# EasyEDA Pro project 主控板.epro

# Schematic Schematic2
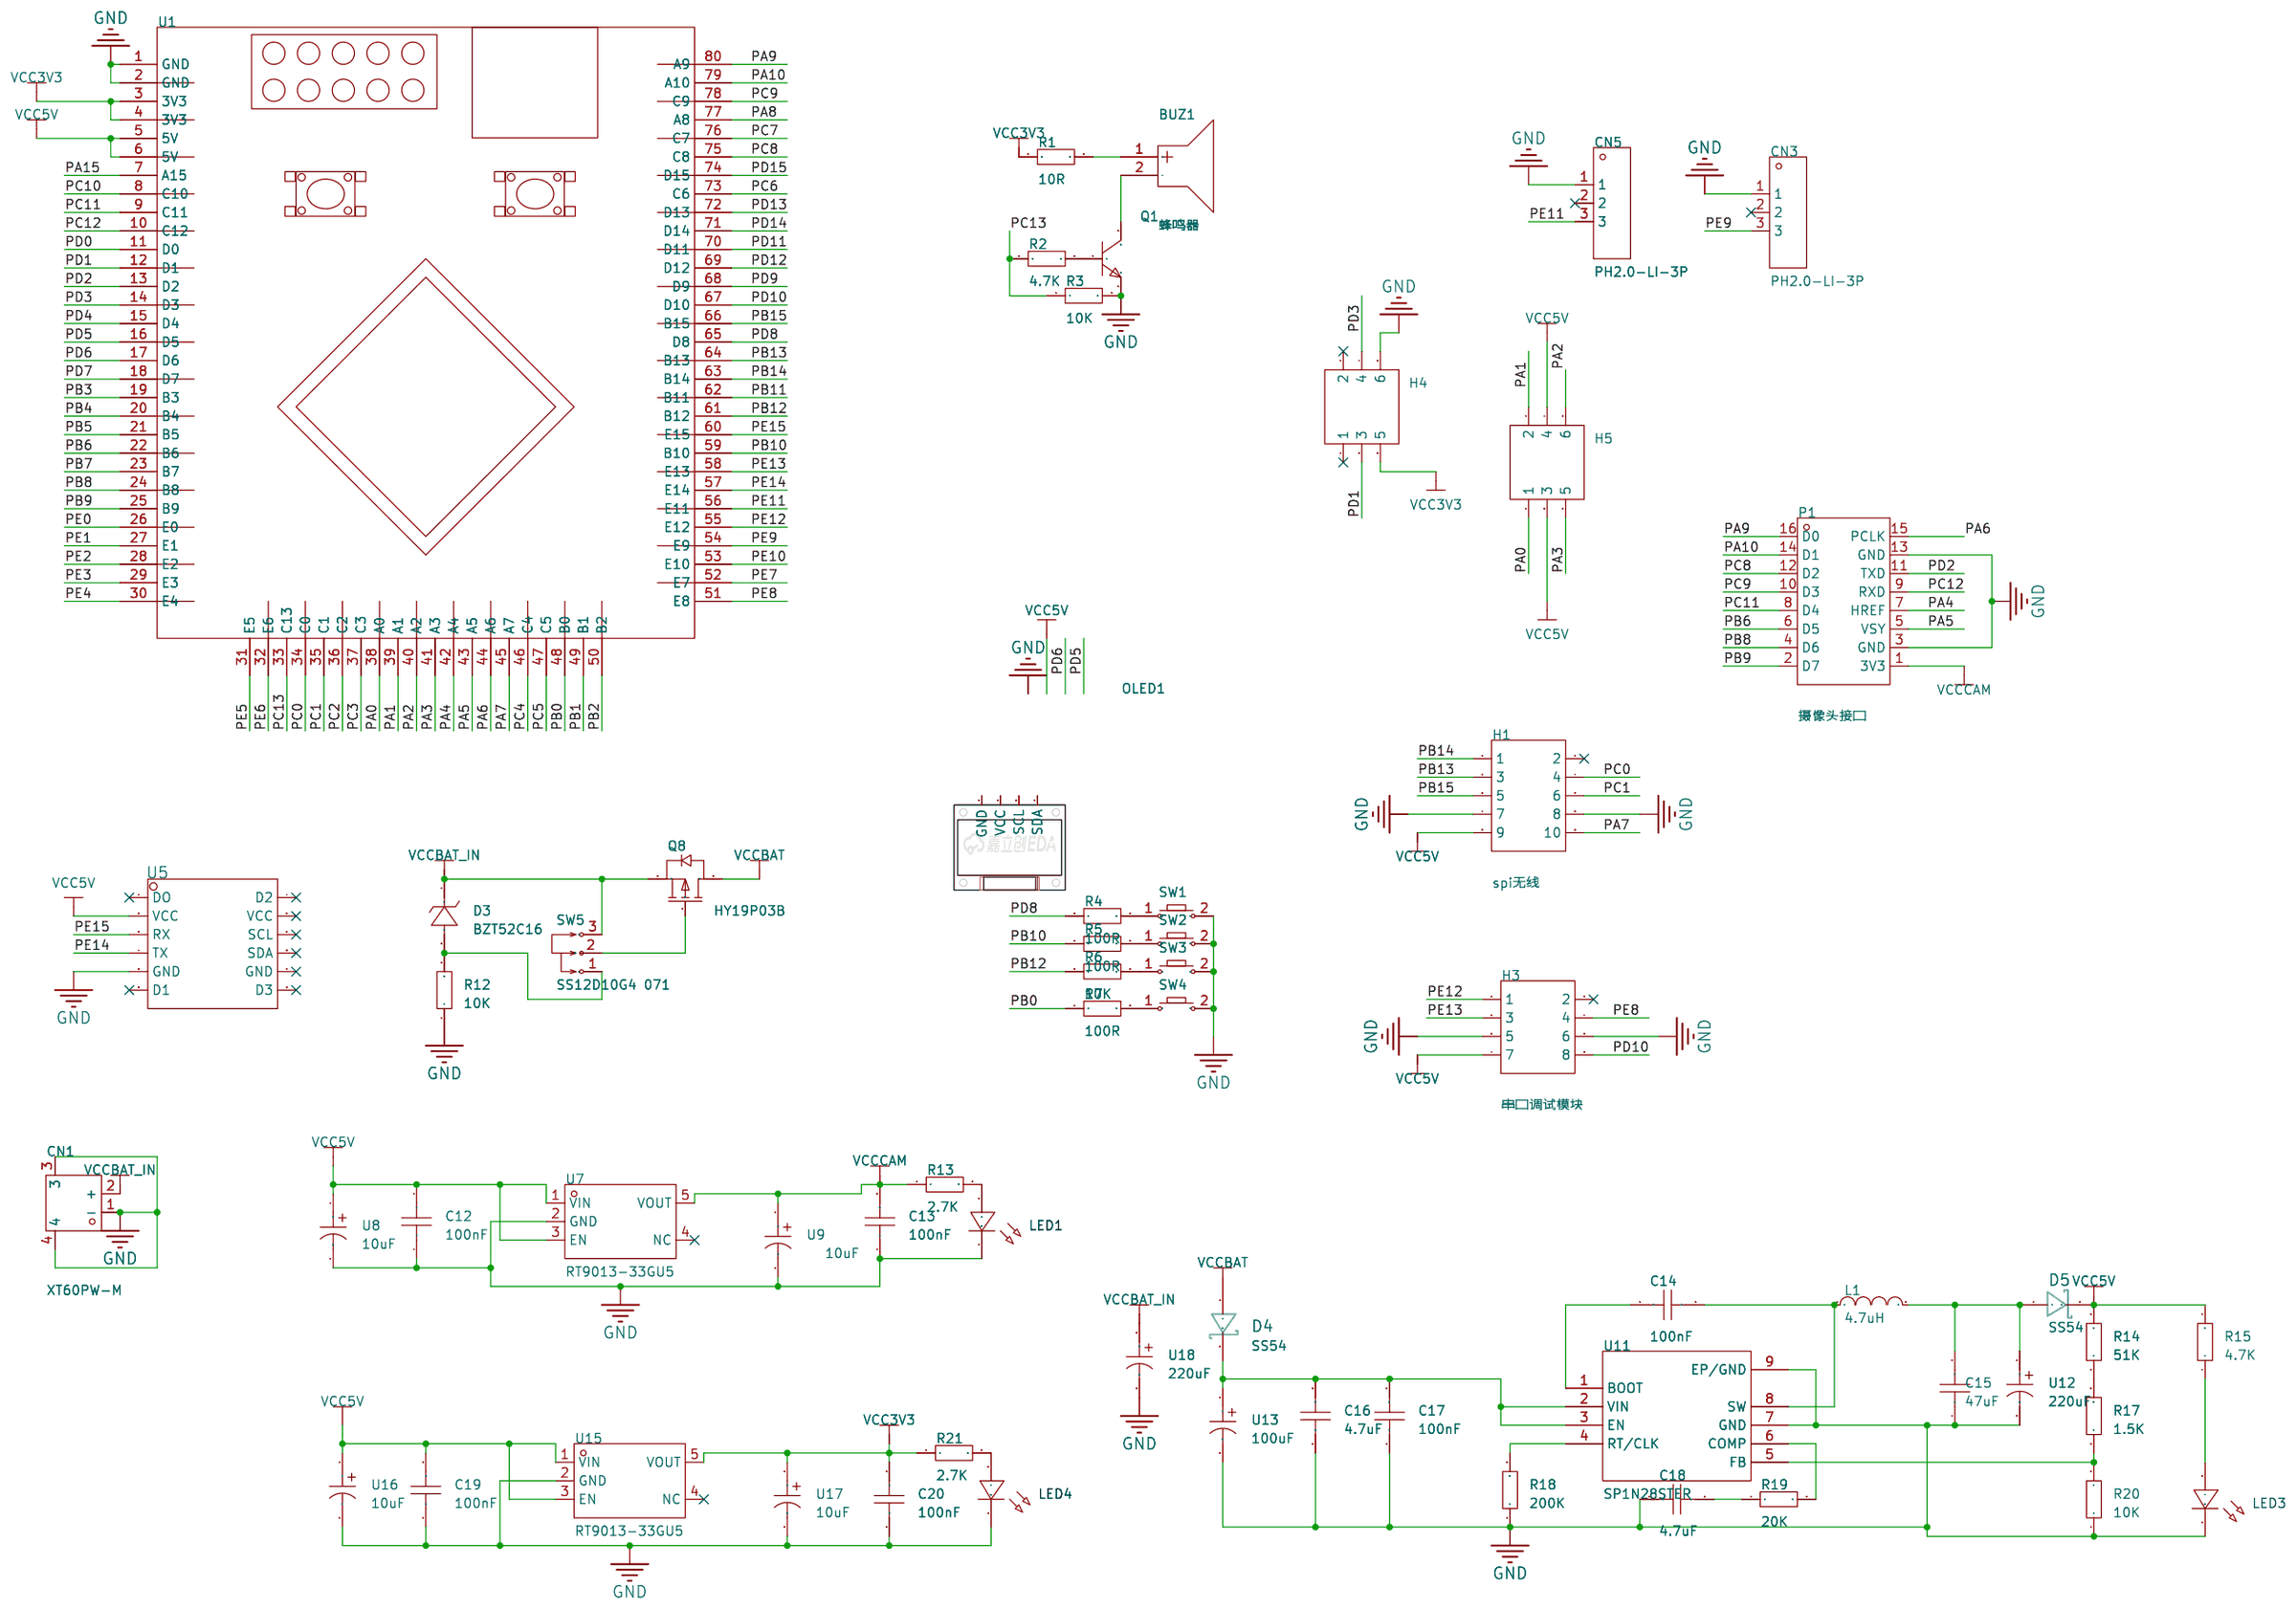
[diagram p0: schematic sheet]

## Parts
BUZ1  蜂鸣器  [BUZ-TH_BD9.0-P5.00-D0.6-FD]
C12  100nF  [C0603]
C13  100nF  [C0603]
C14  100nF  [C0603]
C15  47uF  [c1206]
C16  4.7uF  [C0603]
C17  100nF  [C0603]
C18  4.7uF  [C0603]
C19  100nF  [C0603]
C20  100nF  [C0603]
CN1  XT60PW-M  [CONN-TH_XT60PW-M]
CN3  PH2.0-LI-3P  [CONN-TH_3P-P2.00_HX20007-3A]
CN5  PH2.0-LI-3P  [CONN-TH_3P-P2.00_HX20007-3A]
D3  BZT52C16  [SOD-123_L2.7-W1.6-LS3.7-RD]
D4  SS54  [do-214ac_l4.7-w2.6-ls5.3-rd]
D5  SS54  [do-214ac_l4.7-w2.6-ls5.3-rd]
H1  spi无线  [HDR-TH_10P-P2.54-V-F-R2-C5-S2.54]
H3  串口调试模块  [HDR-TH_8P-P2.54-V-F-R2-C4-S2.54-1]
H4  -  [HDR-TH_6P-P2.54-V-F-R2-C3-S2.54]
H5  -  [HDR-TH_6P-P2.54-V-F-R2-C3-S2.54]
L1  4.7uH  [ind-smd_l4.2-w4.2_mcw-0420]
LED1  -  [LED_0603]
LED3  -  [LED_0603]
LED4  -  [LED_0603]
OLED1  -  [0.96OLED_4P]
P1  摄像头接口  [总钻风摄像头接口]
Q1  -  [S8050_SOT-23]
Q8  HY19P03B  [to-252-2_l6.5-w6.2-p4.57-ls10.0-br-cw]
R1  10R  [R0603]
R2  4.7K  [R0603]
R3  10K  [R0603]
R4  10K  [R0603]
R5  10K  [R0603]
R6  10K  [R0603]
R7  10K  [R0603]
R12  10K  [R0603]
R13  2.7K  [R0603]
R14  51K  [R0603]
R15  4.7K  [R0603]
R17  1.5K  [R0603]
R18  200K  [R0603]
R19  20K  [R0603]
R20  10K  [R0603]
R21  2.7K  [R0603]
SW1  -  [Key_SMD_3x4x2]
SW2  -  [Key_SMD_3x4x2]
SW3  -  [Key_SMD_3x4x2]
SW4  -  [Key_SMD_3x4x2]
SW5  SS12D10G4 071  [SW-TH_SHOU-HAN_SS12D10G4]
U1  -  [CH32V307VCT6核心板]
U5  -  [维特智能JY901S]
U7  RT9013-33GU5  [sot-23-5_l2.9-w1.7-p0.95-ls2.8-bl]
U8  10uF  [case-a_3216]
U9  10uF  [case-a_3216]
U11  SP1N28STER  [ESOP-8_L4.9-W3.9-P1.27-LS6.0-TL-EP]
U12  220uF  [CAP-SMD_L7.3-W4.3-FD]
U13  100uF  [case-c_6032]
U15  RT9013-33GU5  [sot-23-5_l2.9-w1.7-p0.95-ls2.8-bl]
U16  10uF  [case-a_3216]
U17  10uF  [case-a_3216]
U18  220uF  [CAP-SMD_L7.3-W4.3-FD]

## Library data of the parts
BUZ1 = 蜂鸣器: Supplier Part: C9900020875; Supplier Footprint: 插件; JLCPCB Part Class: 扩展库; Supplier: LCSC
C12-C20 = CAP_0603: Supplier Footprint: 0603
CN1 = XT60PW-M: 类别:-;类型1:-;; LCSC Part Name: AMASS(艾迈斯)航模插头xt60连接器150公母对接pw锂电池公头 板插卧式XT60PW-M; Supplier Part: C98732; Manufacturer: AMASS(艾迈斯); JLCPCB Part Class: 扩展库; Datasheet: https://atta.szlcsc.com/upload/public/pdf/source/20190916/C428722_DFF78979486FCB0B58C1FC563067EC88.pdf; Supplier: LCSC; Brand: 艾迈斯; Type: 卧式插头; Colour: 黄色; InterfaceType: 公头
CN3 CN5 = PH2.0-LI-3P: Supplier Part: C9900014054; JLCPCB Part Class: 扩展库; Supplier: LCSC
D3 = BZT52C16: 稳压值(标称值):-;功率:500mW;精度:-;; Supplier Part: C707145; Manufacturer: Slkor(萨科微); Supplier Footprint: SOD-123; JLCPCB Part Class: 扩展库; Datasheet: https://atta.szlcsc.com/upload/public/pdf/source/20200721/C707125_BAEA70ACC1B0F60BBAC1FD71D8806D24.pdf; Supplier: LCSC; Reverse Leakage Current (Ir): 100nA@11.2V; Power Dissipation: 500mW
D4 D5 = SS54: Supplier: LCSC; Manufacturer: MDD; Supplier Part: C22452; JLCPCB Part Class: 基础库
H1 = HDR-F_2.54_2x5: Supplier Part: C92270; Supplier Footprint: 插件
H3 = HDR-F_2.54_2x4: Supplier Part: C92271; Supplier Footprint: 插件
H4 H5 = HDR-F_2.54_2x3: Supplier Part: C92272; Supplier Footprint: 插件
L1 = L_0603: Supplier Footprint: L0603
LED1 LED3 LED4 = LED_0603-G: Supplier Footprint: 0603
OLED1 = 0.96OLED模块_4P: Supplier Footprint: 插件
P1 = 总钻风
Q1 = S8050_SOT_NPN: Supplier Footprint: SOT-23
Q8 = HY19P03B: 类型:P沟道;漏源电压(Vdss):30V;连续漏极电流(Id):90A;功率(Pd):96W;导通电阻(RDS(on)@Vgs,Id):6mΩ@10V,45A;阈值电压(Vgs(th)@Id):3V@250uA;; LCSC Part Name: P沟道 耐压:30V 电流:90A; Supplier Part: C410273; Manufacturer: HUAYI(华羿微); Supplier Footprint: TO-263-2; JLCPCB Part Class: 扩展库; Datasheet: https://atta.szlcsc.com/upload/public/pdf/source/20190807/C410273_E48EFC57468E7FED7A0093963248504B.pdf; Supplier: LCSC; Type: P沟道; Drain Source Voltage (Vdss): 30V; Continuous Drain Current (Id): 90A; Power Dissipation (Pd): 96W; Drain Source On Resistance (RDS(on)@Vgs,Id): 6mΩ@10V,45A; Gate Threshold Voltage (Vgs(th)@Id): 3V@250uA
R1-R7 R12-R15 R17-R21 = Res_0603: Supplier Footprint: 0603
SW1-SW4 = Key_SMD_3x4x2: Supplier Footprint: SMD
SW5 = SS12D10G4 071: 电路结构:单刀双掷;安装方式:直插;开关颜色:-;额定电流(DC):2A;额定电压(DC):125V;额定电流(AC):-;额定电压(AC):-;机械寿命:3千次;; Supplier Part: C2887259; Manufacturer: SHOU HAN(首韩); Supplier Footprint: 插件; JLCPCB Part Class: 扩展库; Datasheet: https://atta.szlcsc.com/upload/public/pdf/source/20210820/80D1704BBF3FCEE0435FCAA54C61E0A3.pdf; Supplier: LCSC; Circuit: 单刀双掷; Pin Style: PC引脚; Switch Length: 12.7mm; Switch Width: 6.7mm; Switch Height: 6.4mm; Mounting Style: 直插; Current Rating (DC): 2A; Voltage Rating (DC): 125V; Mechanical Life: 3千次; Operating Temperature: -16℃~+60℃
U1 = CH32V307VCT6
U5 = JY901S: 9轴姿态角度传感器
U7 U15 = RT9013-33GU5: 输出类型:固定;最大输入电压:5.5V;输出电压:3.3V;最大输出电流:500mA;电源纹波抑制比(PSRR):50dB@(10kHz);输出极性:正极;; Supplier Part: C3034127; Manufacturer: RICHTEK(立锜); Supplier Footprint: SC-70-5; JLCPCB Part Class: 扩展库; Datasheet: https://atta.szlcsc.com/upload/public/pdf/source/20220613/DD4CF7EAF1F9097C51D5D7DB1A8622BA.pdf; Supplier: LCSC; Output Type: 固定; Maximum Input Voltage: 5.5V; Output Voltage: 3.3V; MAX Output Current: 500mA; Power Supply Rejection Ratio (PSRR): 50dB@(10kHz); Dropout Voltage: 400mV@(500mA); standby current: 50uA; Operating Temperature: -40℃~+85℃; Output Polarity: 正极; Number of Outputs: 1
U8 U9 U12 U13 U16-U18 = TPSE477M010R0050: 容值:470uF;精度:±20%;额定电压:10V;等效串联电阻:50mΩ@100kHZ;; LCSC Part Name: 470uF ±20% 10V; Supplier Part: C1954116; Manufacturer: Kyocera AVX; Supplier Footprint: CASE-E-7343; JLCPCB Part Class: 扩展库; Datasheet: https://atta.szlcsc.com/upload/public/pdf/source/20210915/CADAB6E31BEA793A8D1CD3C13B75E922.pdf; Supplier: LCSC; Tolerance: ±20%; Rated Voltage: 10V; Equivalent Series Resistance(ESR): 50mΩ@100kHZ; Operating Temperature: -55℃~+125℃
U11 = SP1N28STER: Supplier: LCSC; Manufacturer: TI(德州仪器); Manufacturer Part: TPS5430DDAR; Supplier Part: C9864; JLCPCB Part Class: 基础库; LCSC Part Name: TPS5430DDAR; Supplier Footprint: SOP-8-EP; Datasheet: https://www.ti.com/cn/lit/gpn/tps5430; Function: 降压型; Synchronous Rectification: 否; Output Type: 可调; Number of Outputs: 1; Topology: 降压式; Input Voltage: 5.5V~36V; Output Voltage: 1.221V~32.04V; Output Current (Max): 3A; Switching Frequency: 500kHz; Operating Temperature: -40℃~+125℃@(TJ)

## Nets
GND: C12.1 C13.1 C15.1 C16.1 C17.1 C18.1 C19.1 C20.1 CN1.1(-) CN1.3 CN1.4 CN3.1 CN5.1 H1.7 H1.8 H3.5 H3.6 H4.6 LED1.1(C) LED3.1(C) LED4.1(C) P1.3(GND) P1.13(GND) Q1.2 R3.2 R12.1 R18.1 R20.1 SW1.2 SW2.2 SW3.2 SW4.2 U1.1(GND) U1.2(GND) U5.5(GND) U7.2(GND) U8.2 U9.2 U11.7(GND) U11.9(EP/GND) U12.2 U13.2 U15.2(GND) U16.2 U17.2 U18.2
VCC3V3: C20.2 H4.5 R1.1 R21.1 U1.3(3V3) U1.4(3V3) U15.5(VOUT) U17.1
VCC5V: C12.2 C19.2 D5.2(K) H1.9 H3.7 H5.3 H5.4 R14.2 R15.2 U1.5(5V) U1.6(5V) U5.2(VCC) U7.1(VIN) U7.3(EN) U8.1 U15.1(VIN) U15.3(EN) U16.1
VCCBAT: D4.1(A) Q8.2(D)
VCCBAT_IN: CN1.2(+) D3.1(K) Q8.3(S) SW5.3 U18.1
VCCCAM: C13.2 P1.1(3V3) R13.1 U7.5(VOUT) U9.1
PA0: H5.1 U1.38(A0)
PA1: H5.2 U1.39(A1)
PA2: H5.6 U1.40(A2)
PA3: H5.5 U1.41(A3)
PA4: P1.7(HREF) U1.42(A4)
PA5: P1.5(VSY) U1.43(A5)
PA6: P1.15(PCLK) U1.44(A6)
PA7: H1.10 U1.45(A7)
PA8: U1.77(A8)
PA9: P1.16(D0) U1.80(A9)
PA10: P1.14(D1) U1.79(A10)
PA15: U1.7(A15)
PB0: R7.1 U1.48(B0)
PB1: U1.49(B1)
PB2: U1.50(B2)
PB3: U1.19(B3)
PB4: U1.20(B4)
PB5: U1.21(B5)
PB6: P1.6(D5) U1.22(B6)
PB7: U1.23(B7)
PB8: P1.4(D6) U1.24(B8)
PB9: P1.2(D7) U1.25(B9)
PB10: R5.1 U1.59(B10)
PB11: U1.62(B11)
PB12: R6.1 U1.61(B12)
PB13: H1.3 U1.64(B13)
PB14: H1.1 U1.63(B14)
PB15: H1.5 U1.66(B15)
PC0: H1.4 U1.34(C0)
PC1: H1.6 U1.35(C1)
PC2: U1.36(C2)
PC3: U1.37(C3)
PC4: U1.46(C4)
PC5: U1.47(C5)
PC6: U1.73(C6)
PC7: U1.76(C7)
PC8: P1.12(D2) U1.75(C8)
PC9: P1.10(D3) U1.78(C9)
PC10: U1.8(C10)
PC11: P1.8(D4) U1.9(C11)
PC12: P1.9(RXD) U1.10(C12)
PC13: R2.1 R3.1 U1.33(C13)
PD0: U1.11(D0)
PD1: H4.3 U1.12(D1)
PD2: P1.11(TXD) U1.13(D2)
PD3: H4.4 U1.14(D3)
PD4: U1.15(D4)
PD5: U1.16(D5)
PD6: U1.17(D6)
PD7: U1.18(D7)
PD8: R4.1 U1.65(D8)
PD9: U1.68(D9)
PD10: H3.8 U1.67(D10)
PD11: U1.70(D11)
PD12: U1.69(D12)
PD13: U1.72(D13)
PD14: U1.71(D14)
PD15: U1.74(D15)
PE0: U1.26(E0)
PE1: U1.27(E1)
PE2: U1.28(E2)
PE3: U1.29(E3)
PE4: U1.30(E4)
PE5: U1.31(E5)
PE6: U1.32(E6)
PE7: U1.52(E7)
PE8: H3.4 U1.51(E8)
PE9: CN3.3 U1.54(E9)
PE10: U1.53(E10)
PE11: CN5.3 U1.56(E11)
PE12: H3.1 U1.55(E12)
PE13: H3.3 U1.58(E13)
PE14: U1.57(E14) U5.4(TX)
PE15: U1.60(E15) U5.3(RX)
$1N2384: Q8.1(G) SW5.2
$1N2385: D3.2(A) R12.2 SW5.1
$1N2976: LED1.2(A) R13.2
$1N2980: LED4.2(A) R21.2
$1N3513: C16.2 C17.2 D4.2(K) U11.2(VIN) U11.3(EN) U13.1
$1N3514: R18.2 U11.4(RT/CLK)
$1N3515: C14.1 U11.1(BOOT)
$1N3516: C14.2 L1.1 U11.8(SW)
$1N3518: C15.2 D5.1(A) L1.2 U12.1
$1N3520: R14.1 R17.2
$1N3521: R17.1 R20.2 U11.5(FB)
$1N3522: C18.2 R19.1
$1N3523: R19.2 U11.6(COMP)
$1N3524: LED3.2(A) R15.1
$1N3913: R4.2 SW1.1
$1N3914: R5.2 SW2.1
$1N3915: R6.2 SW3.1
$1N3916: R7.2 SW4.1
$1N4132: Q1.1 R2.2
$1N4134: BUZ1.1(+) R1.2
$1N4135: BUZ1.2(-) Q1.3

Not connected (* = marked no-connect by the designer): CN3 2*; CN5 2*; H1 2*; H3 2*; H4 1* 2*; OLED1 1(GND) 2(VCC) 3(SCL) 4(SDA); U5 1(DO)* 6(D1)* 7(D2)* 8(VCC)* 9(SCL)* 10(SDA)* 11(GND)* 12(D3)*; U7 4(NC)*; U15 4(NC)*

# Board PCB2
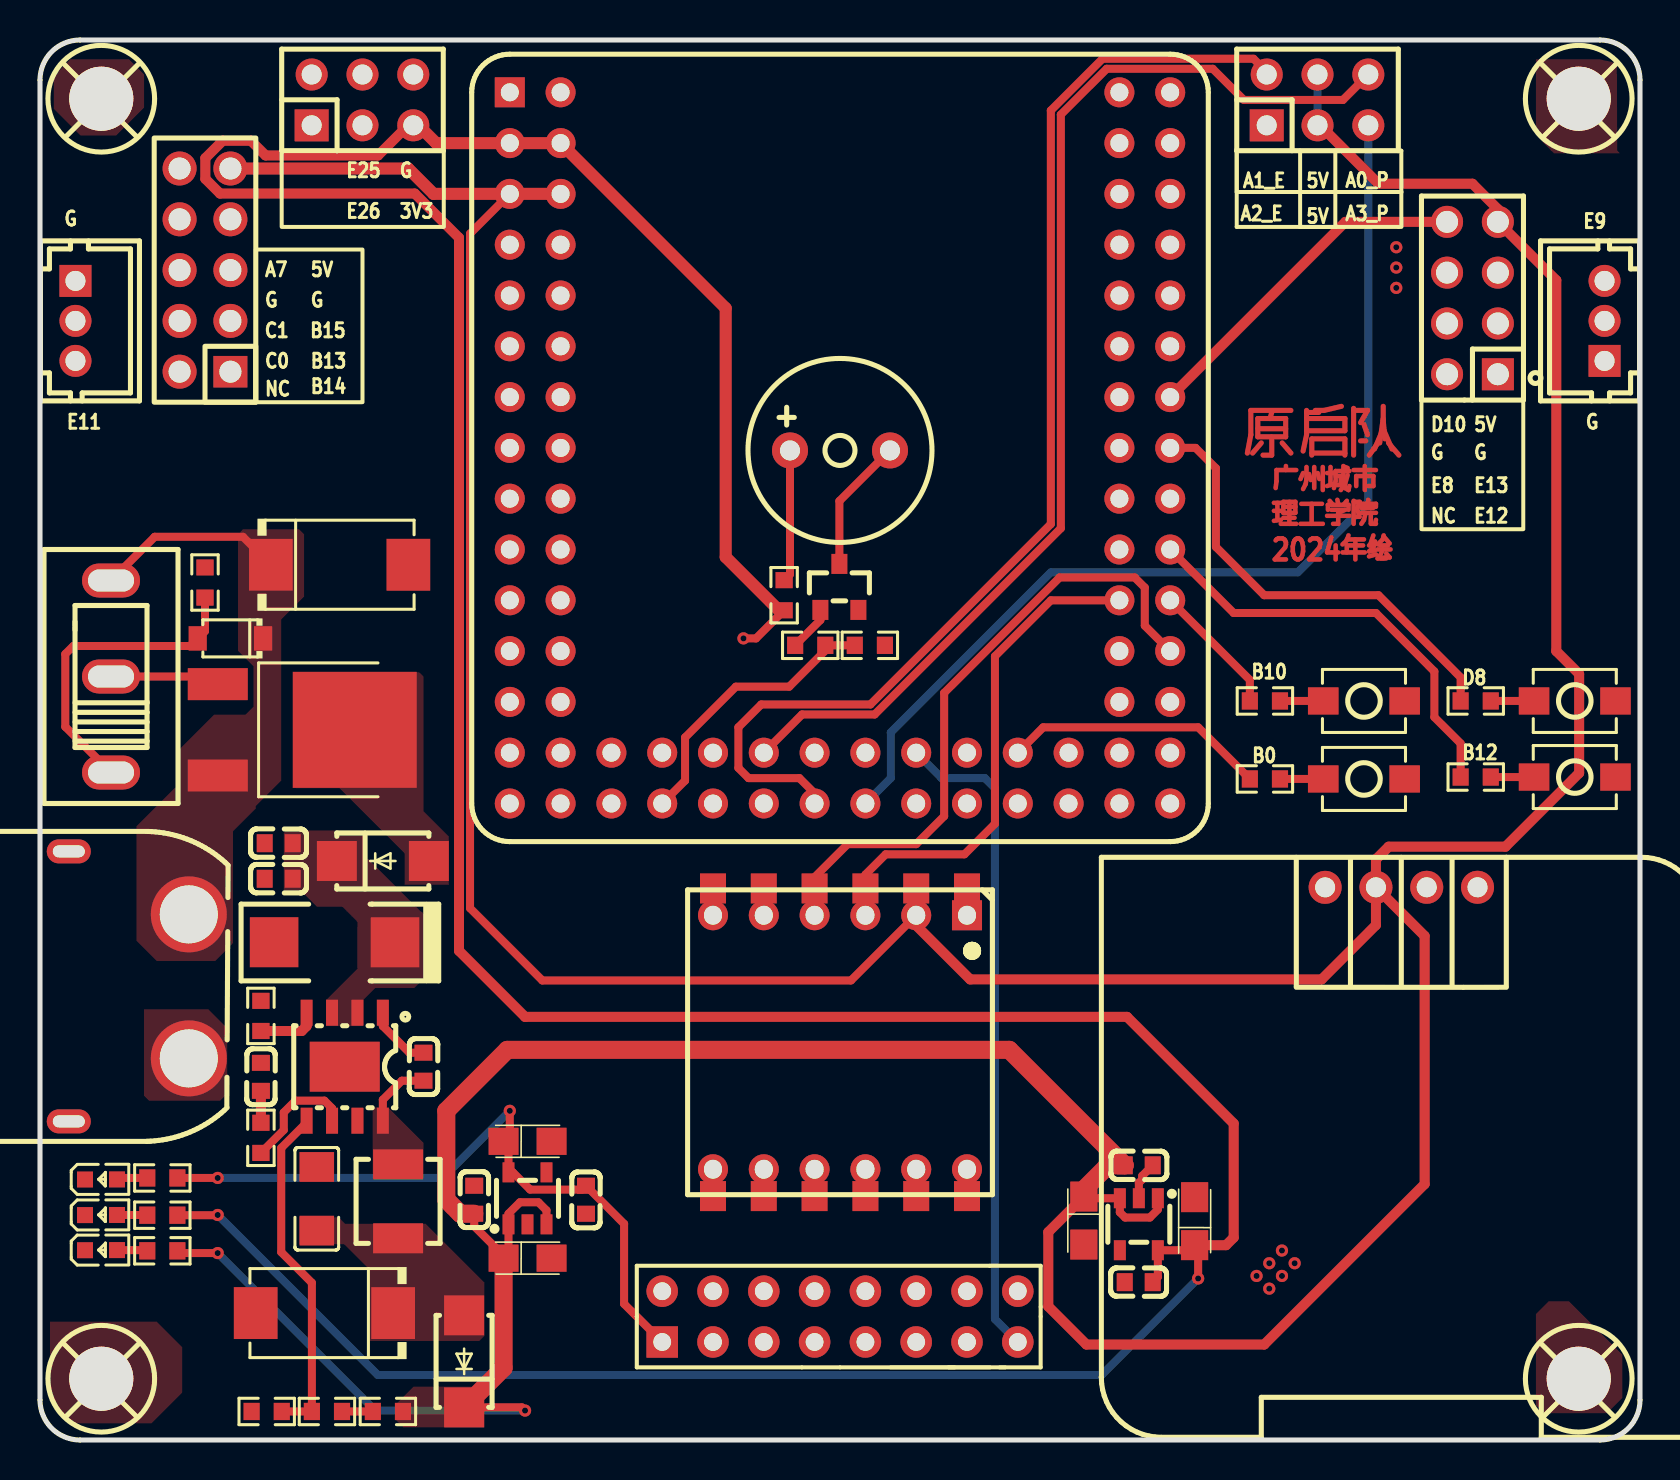
[diagram p1: board, top side]
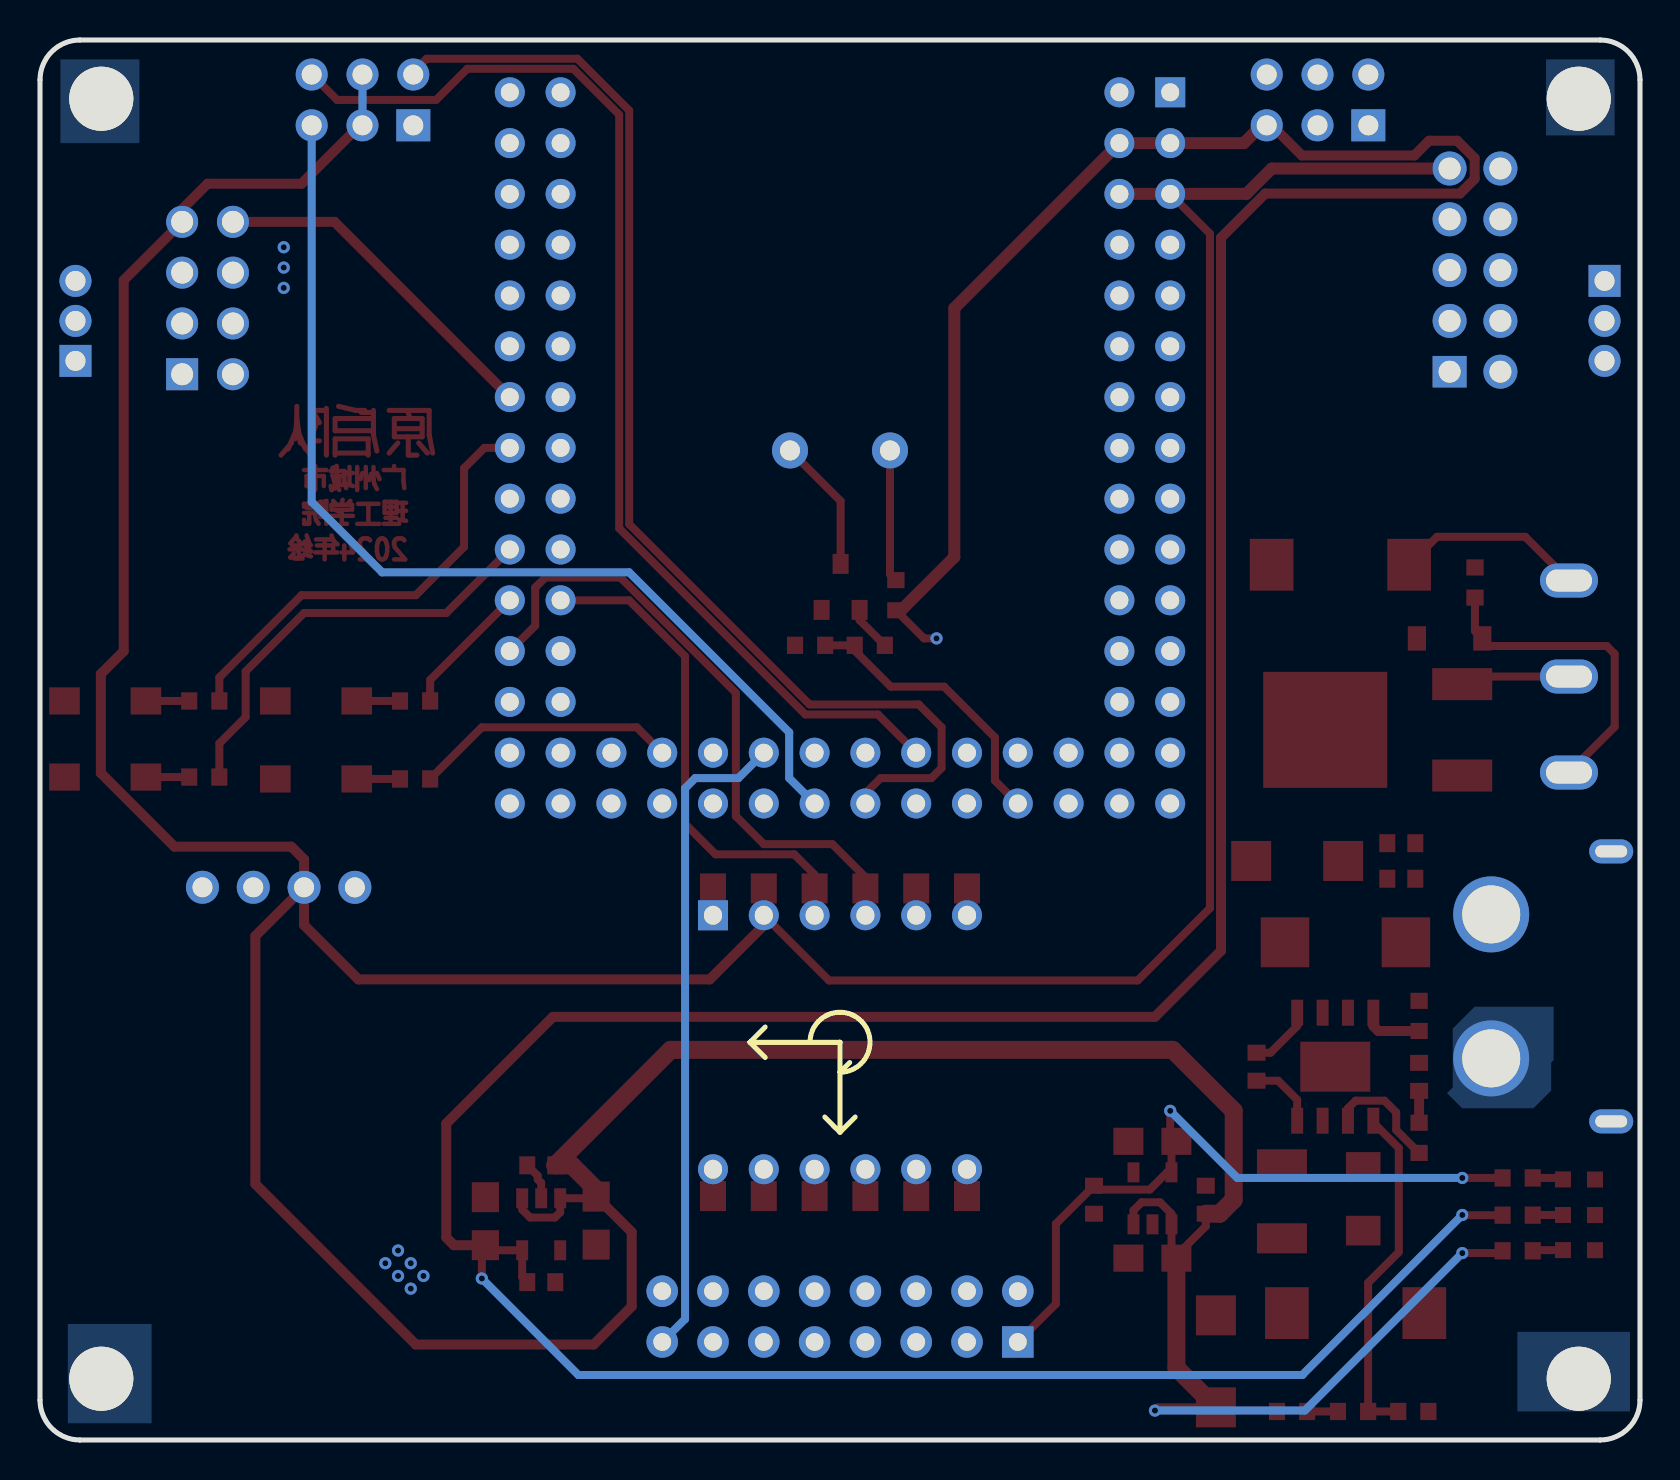
[diagram p2: board, bottom side, seen from below]

Outline 80 x 70 mm; copper layers: Top Layer, Inner1, Inner2, Bottom Layer. Coordinates in mm from the lower left corner of the outline.
Outline path: 0,68 0,2 arc(0.59,0.59) 2,0 78,0 arc(79.41,0.59) 80,2 80,68 arc(79.41,69.41) 78,70 2,70 arc(0.59,69.41) 0,68
Stack: Top Layer 0.035mm 外层铜厚1oz / Dielectric1 0.2104mm 7628 RC49% 8.6mil / Inner1 0.0152mm 内层铜厚 / Dielectric2 1.065mm 1.1mm H/HOZ 含铜 / Inner2 0.0152mm 内层铜厚 / Dielectric3 0.2104mm 7628 RC49% 8.6mil / Bottom Layer 0.035mm 外层铜厚1oz

## Design rules (mm)
template: JLCPCB Capability(Two Layers Board)
spacing copperThickness1oz (default): track to track 0.102, other pairs 0.152 to 0.3
spacing copperThickness2oz: track to track 0.203, other pairs 0.152 to 0.3
track width copperThickness1oz (default): min 0.127, default 0.254, max 2.54
track width copperThickness2oz: min 0.203, default 0.254, max 2.54
differential pair differentialPair (default): width min 0.127, default 0.254, max 2.54; gap min 0.152, default 0.152
via viaSize (default): diameter min 0.5, default 0.61, max 10; hole min 0.3, default 0.305, max 6.3

## Placement (name value [footprint] x y rotation side)
BUZ1  蜂鸣器  [BUZ-TH_BD9.0-P5.00-D0.6-FD]  40 49.48 0 top
C12  100nF  [C0603]  21.71 12.01 270 top
C13  100nF  [C0603]  27.3 12.01 90 top
C14  100nF  [C0603]  19.17 18.66 270 top
C15  47uF  [c1206]  13.84 12.06 270 top
C16  4.7uF  [C0603]  11.93 29.84 0 top
C17  100nF  [C0603]  11.93 28.06 0 top
C18  4.7uF  [C0603]  11.05 18.16 270 top
C19  100nF  [C0603]  54.94 13.74 180 top
C20  100nF  [C0603]  54.94 7.89 0 top
CN1  XT60PW-M  [CONN-TH_XT60PW-M]  4.44 22.68 0 top
CN3  PH2.0-LI-3P  [CONN-TH_3P-P2.00_HX20007-3A]  78.23 55.95 270 top
CN5  PH2.0-LI-3P  [CONN-TH_3P-P2.00_HX20007-3A]  1.77 55.95 90 top
D3  BZT52C16  [SOD-123_L2.7-W1.6-LS3.7-RD]  9.52 40.08 180 top
D4  SS54  [do-214ac_l4.7-w2.6-ls5.3-rd]  17.14 28.95 0 top
D5  SS54  [do-214ac_l4.7-w2.6-ls5.3-rd]  21.21 3.93 90 top
H1  spi无线  [HDR-TH_10P-P2.54-V-F-R2-C5-S2.54]  8.25 58.5 90 top
H3  串口调试模块  [HDR-TH_8P-P2.54-V-F-R2-C4-S2.54-1]  71.62 57.1 90 top
H4  -  [HDR-TH_6P-P2.54-V-F-R2-C3-S2.54]  16.12 67 0 top
H5  -  [HDR-TH_6P-P2.54-V-F-R2-C3-S2.54]  63.88 67 0 top
L1  4.7uH  [ind-smd_l4.2-w4.2_mcw-0420]  17.9 11.93 270 top
LED1  -  [LED_0603]  3.1 13.03 0 top
LED3  -  [LED_0603]  3.1 9.5 0 top
LED4  -  [LED_0603]  3.1 11.26 0 top
OLED1  -  [0.96OLED_4P]  68.07 27.63 0 top
P1  摄像头接口  [总钻风摄像头接口]  38.73 6.17 90 top
Q1  -  [S8050_SOT-23]  39.84 42.66 270 top
Q8  HY19P03B  [to-252-2_l6.5-w6.2-p4.57-ls10.0-br-cw]  12.31 35.51 180 top
R1  10R  [R0603]  37.21 42.24 90 top
R2  4.7K  [R0603]  38.51 39.73 180 top
R3  10K  [R0603]  41.49 39.73 0 top
R4  10K  [R0603]  71.79 36.95 0 top
R5  10K  [R0603]  61.25 36.95 0 top
R6  10K  [R0603]  71.79 33.15 0 top
R7  10K  [R0603]  61.25 33.05 0 top
R12  10K  [R0603]  8.25 42.87 270 top
R13  2.7K  [R0603]  6.12 13.1 180 top
R14  51K  [R0603]  17.4 1.43 0 top
R15  4.7K  [R0603]  6.12 9.46 0 top
R17  1.5K  [R0603]  14.35 1.43 0 top
R18  200K  [R0603]  11.05 21.2 270 top
R19  20K  [R0603]  11.05 15.11 270 top
R20  10K  [R0603]  11.33 1.43 0 top
R21  2.7K  [R0603]  6.12 11.24 180 top
SCREW1  -  [M3螺丝]  3.13 67 0 top
SCREW2  -  [M3螺丝]  77 67 0 top
SCREW3  -  [M3螺丝]  77 3 0 top
SCREW4  -  [M3螺丝]  3.13 3 0 top
SW1  -  [Key_SMD_3x4x2]  76.74 36.95 0 top
SW2  -  [Key_SMD_3x4x2]  66.2 36.95 0 top
SW3  -  [Key_SMD_3x4x2]  76.74 33.15 0 top
SW4  -  [Key_SMD_3x4x2]  66.2 33.05 0 top
SW5  SS12D10G4 071  [SW-TH_SHOU-HAN_SS12D10G4]  3.55 38.17 90 top
U1  -  [CH32V307VCT6核心板]  53.59 54.94 0 top
U5  -  [维特智能JY901S]  40 19.89 270 top
U7  RT9013-33GU5  [sot-23-5_l2.9-w1.7-p0.95-ls2.8-bl]  24.38 12.08 0 top
U8  10uF  [case-a_3216]  24.38 9.09 0 top
U9  10uF  [case-a_3216]  24.38 14.93 0 top
U11  SP1N28STER  [ESOP-8_L4.9-W3.9-P1.27-LS6.0-TL-EP]  15.24 18.66 270 top
U12  220uF  [CAP-SMD_L7.3-W4.3-FD]  14.22 6.35 180 top
U13  100uF  [case-c_6032]  14.73 24.89 0 top
U15  RT9013-33GU5  [sot-23-5_l2.9-w1.7-p0.95-ls2.8-bl]  54.94 10.79 180 top
U16  10uF  [case-a_3216]  52.19 10.97 270 top
U17  10uF  [case-a_3216]  57.73 10.94 90 top
U18  220uF  [CAP-SMD_L7.3-W4.3-FD]  14.98 43.76 0 top

## Footprints (pads in the part's own frame, mm; a bottom-side part is the same pattern mirrored in y, then rotated)
0.96OLED_4P
  round 1.65 hole 1: 1(-3.81,-0.002) 2(-1.27,0.002) 3(1.27,0.002) 4(3.81,0.002)
BUZ-TH_BD9.0-P5.00-D0.6-FD
  round 1.8 hole 1: 1(-2.5,0) 2(2.5,0)
C0603
  rect 0.8x0.9 smd: 1(-0.7,0) 2(0.7,0)
c1206
  rect 1.485x1.728 smd: 1(-1.593,0) 2(1.593,0)
CAP-SMD_L7.3-W4.3-FD
  rect 2.185x2.592 smd: 1(-3.437,0) 2(3.437,0)
case-a_3216
  rect 1.5x1.359 smd: 1(-1.2,0) 2(1.2,0)
case-c_6032
  rect 2.425x2.5 smd: 1(3.022,0) 2(-3.022,0)
CH32V307VCT6核心板
  rect 1.5x1.5 hole 0.9: 1(-30.099,12.446)
  round 1.5 hole 0.9: 2(-27.559,12.446) 3(-30.099,9.906) 4(-27.559,9.906) 5(-30.099,7.366) 6(-27.559,7.366) 7(-30.099,4.826) 8(-27.559,4.826) 9(-30.099,2.286) 10(-27.559,2.286) 11(-30.099,-0.254) 12(-27.559,-0.254) 13(-30.099,-2.794) 14(-27.559,-2.794) 15(-30.099,-5.334) 16(-27.559,-5.334) 17(-30.099,-7.874) 18(-27.559,-7.874) 19(-30.099,-10.414) 20(-27.559,-10.414) 21(-30.099,-12.954) 22(-27.559,-12.954) 23(-30.099,-15.494) 24(-27.559,-15.494) 25(-30.099,-18.034) 26(-27.559,-18.034) 27(-30.099,-20.574) 28(-27.559,-20.574) 29(-30.099,-23.114) 30(-27.559,-23.114) 31(-25.019,-23.114) 32(-25.019,-20.574) 33(-22.479,-23.114) 34(-22.479,-20.574) 35(-19.939,-23.114) 36(-19.939,-20.574) 37(-17.399,-23.114) 38(-17.399,-20.574) 39(-14.859,-23.114) 40(-14.859,-20.574) 41(-12.319,-23.114) 42(-12.319,-20.574) 43(-9.779,-23.114) 44(-9.779,-20.574) 45(-7.239,-23.114) 46(-7.239,-20.574) 47(-4.699,-23.114) 48(-4.699,-20.574) 49(-2.159,-23.114) 50(-2.159,-20.574) 51(2.921,-23.114) 52(0.381,-23.114) 53(2.921,-20.574) 54(0.381,-20.574) 55(2.921,-18.034) 56(0.381,-18.034) 57(2.921,-15.494) 58(0.381,-15.494) 59(2.921,-12.954) 60(0.381,-12.954) 61(2.921,-10.414) 62(0.381,-10.414) 63(2.921,-7.874) 64(0.381,-7.874) 65(2.921,-5.334) 66(0.381,-5.334) 67(2.921,-2.794) 68(0.381,-2.794) 69(2.921,-0.254) 70(0.381,-0.254) 71(2.921,2.286) 72(0.381,2.286) 73(2.921,4.826) 74(0.381,4.826) 75(2.921,7.366) 76(0.381,7.366) 77(2.921,9.906) 78(0.381,9.906) 79(2.921,12.446) 80(0.381,12.446)
CONN-TH_3P-P2.00_HX20007-3A
  rect 1.6x1.6 hole 1: 1(2,0)
  round 1.6 hole 1: 2(0,0) 3(-2,0)
CONN-TH_XT60PW-M
  round 3.8 hole 2.9: 1(3,-3.6) 2(3,3.6)
  oval 2.2x1.2 hole 1.6x0.6: 3(-3,6.75) 4(-3,-6.75)
do-214ac_l4.7-w2.6-ls5.3-rd
  rect 2x2 smd: 1(2.3,0) 2(-2.3,0)
ESOP-8_L4.9-W3.9-P1.27-LS6.0-TL-EP
  rect 1.3x0.6 smd: 1(-2.7,1.905) 2(-2.7,0.635) 3(-2.7,-0.635) 4(-2.7,-1.905) 5(2.7,-1.905) 6(2.7,-0.635) 7(2.7,0.635) 8(2.7,1.905)
  rect 2.5x3.5 smd: 9(0,0)
HDR-TH_6P-P2.54-V-F-R2-C3-S2.54
  rect 1.7x1.6 hole 1: 1(-2.54,-1.27)
  round 1.6 hole 1: 2(-2.54,1.27) 3(0,-1.27) 4(0,1.27) 5(2.54,-1.27) 6(2.54,1.27)
HDR-TH_8P-P2.54-V-F-R2-C4-S2.54-1
  rect 1.6x1.6 hole 1.1: 1(-3.81,-1.27)
  round 1.6 hole 1.1: 2(-3.81,1.27) 3(-1.27,-1.27) 4(-1.27,1.27) 5(1.27,-1.27) 6(1.27,1.27) 7(3.81,-1.27) 8(3.81,1.27)
HDR-TH_10P-P2.54-V-F-R2-C5-S2.54
  rect 1.575x1.7 hole 1.1: 1(-5.08,-1.27)
  round 1.7 hole 1.1: 2(-5.08,1.27) 3(-2.54,-1.27) 4(-2.54,1.27) 5(0,-1.27) 6(0,1.27) 7(2.54,-1.27) 8(2.54,1.27) 9(5.08,-1.27) 10(5.08,1.27)
ind-smd_l4.2-w4.2_mcw-0420
  rect 1.5x2.5 smd: 1(-1.85,0) 2(1.85,0)
Key_SMD_3x4x2
  rect 1.53x1.36 smd: 1(-2.035,0) 2(2.035,0)
LED_0603
  rect 0.8x0.8 smd: 1(-0.851,-0.01) 2(0.75,-0.005)
M3螺丝
  round 3.2 hole 3.2: 1(-0.064,0.064)
R0603
  rect 0.806x0.864 smd: 1(-0.753,0) 2(0.753,0)
S8050_SOT-23
  rect 1x0.8 smd: 1(1.15,-0.823) 2(1.15,1.077) 3(-1.15,0.127)
SOD-123_L2.7-W1.6-LS3.7-RD
  rect 0.91x1.22 smd: 1(-1.635,0) 2(1.635,0)
sot-23-5_l2.9-w1.7-p0.95-ls2.8-bl
  rect 0.6x1 smd: 1(-0.95,-1.3) 2(0,-1.3) 3(0.95,-1.3) 4(0.95,1.3) 5(-0.95,1.3)
SW-TH_SHOU-HAN_SS12D10G4
  oval 1.7x2.9 hole 1.1x2.3: 1(-4.8,0) 2(0,0) 3(4.8,0)
to-252-2_l6.5-w6.2-p4.57-ls10.0-br-cw
  rect 3x1.6 smd: 1(3.424,-2.285) 3(3.424,2.285)
  rect 6.2x5.8 smd: 2(-3.424,0)
总钻风摄像头接口
  rect 1.575x1.575 hole 0.889: 1(-1.27,7.62)
  round 1.575 hole 0.889: 2(1.27,7.62) 3(-1.27,5.08) 4(1.27,5.08) 5(-1.27,2.54) 6(1.27,2.54) 7(-1.27,0) 8(1.27,0) 9(-1.27,-2.54) 10(1.27,-2.54) 11(-1.27,-5.08) 12(1.27,-5.08) 13(-1.27,-7.62) 14(1.27,-7.62) 15(-1.27,-10.16) 16(1.27,-10.16)
维特智能JY901S
  rect 1.501x1.3 smd: 1(-7.691,6.35) 2(-7.691,3.81) 3(-7.691,1.27) 4(-7.691,-1.27) 5(-7.691,-3.81) 6(-7.691,-6.35) 7(7.691,6.35) 8(7.691,3.81) 9(7.691,1.27) 10(7.691,-1.27) 11(7.691,-3.81) 12(7.691,-6.35)
  rect 1.501x1.501 hole 0.945x0.899: 1(-6.35,6.35)
  round 1.501 hole 0.945x0.899: 2(-6.35,3.81) 3(-6.35,1.27) 4(-6.35,-1.27) 5(-6.35,-3.81) 6(-6.35,-6.35) 7(6.35,6.35) 8(6.35,3.81) 9(6.35,1.27) 10(6.35,-1.27) 11(6.35,-3.81) 12(6.35,-6.35)

## Nets
As in the schematic, except:
GND: C12.1 C13.1 C15.1 C16.1 C17.1 C18.1 C19.1 C20.1 CN1.1 CN1.3 CN1.4 CN3.1 CN5.1 H1.7 H1.8 H3.5 H3.6 H4.6 LED1.1 LED3.1 LED4.1 OLED1.1 P1.3 P1.13 Q1.2 R3.2 R12.1 R18.1 R20.1 SCREW1.1 SCREW2.1 SCREW3.1 SCREW4.1 SW1.2 SW2.2 SW3.2 SW4.2 U1.1 U1.2 U5.5 U7.2 U8.2 U9.2 U11.7 U11.9 U12.2 U13.2 U15.2 U16.2 U17.2 U18.2
VCC5V: C12.2 C19.2 D5.2 H1.9 H3.7 H5.3 H5.4 OLED1.2 R14.2 R15.2 U1.5 U1.6 U5.2 U7.1 U7.3 U8.1 U15.1 U15.3 U16.1
PA0: H5.6 U1.38
PA2: H5.1 U1.40
PD5: OLED1.4 U1.16
PD6: OLED1.3 U1.17

Pads without a net: CN3 2; CN5 2; H1 2; H3 2; H4 1 2; U5 1 6 7 8 9 10 11 12; U7 4; U15 4

## Via types
v1: diameter 0.61, hole 0.305, Top Layer to Bottom Layer, 16 vias

## Routing (per net, layer and track width the routed paths; a pad name or vN(x,y) marks a point on that pad's centre or on a via; arc(x,y) is an arc through that point)
GND: length 1.9
  Top Layer w0.4: U15.2 54.94,12.86 55.11,13.03 55.11,13.21 C19.1
  vias: v1(60.83,8.2) v1(61.46,8.84) v1(61.46,7.57) v1(62.1,9.47) v1(62.1,8.2) v1(62.73,8.84) v1(67.81,59.64) v1(67.81,58.62) v1(67.81,57.61)
VCC3V3: length 212.7
  Top Layer w0.4: R21.1 8.76,11.24 ; C20.2 55.89,8.15 U15.5 57.48,9.49 U17.1 57.91,9.56 v1(57.91,8.08) ; v1(35.17,40.08) 35.8,40.08 R1.1
  Top Layer w0.5: U17.1 59.3,9.74 59.69,10.12 59.69,15.82 54.35,21.16 24.25,21.16 20.95,24.46 20.95,60.11 18.74,62.32 9,62.32 8.27,63.06 8.27,64.09 9.14,64.96 10.54,64.96 11.28,64.23 16.9,64.23 18.66,65.99
  Top Layer w0.6: R1.1 36.94,41.49 34.28,44.14 34.28,56.59 U1.4 U1.3 19.81,64.84 18.66,65.99
  Bottom Layer w0.4: v1(57.91,8.08) 53.08,3.25 16.89,3.25 v1(8.89,11.25)
VCC5V: length 300
  Top Layer w0.4: D5.2 24.09,1.63 v1(24.25,1.47) ; U1.5 21.5,60.32 21.5,26.59 25.12,22.98 40.55,22.98 U5.2 ; 21.71,11.31 21.71,10.69 23.18,9.22 23.43,9.46 U7.1 23.43,11.31 24,11.89 24.92,11.89 25.32,11.48 U7.3 ; U15.1 55.89,11.52 55.49,11.12 54.25,11.12 53.99,11.39 U15.3 52.28,12.09 U16.1 ; 63.88,65.86 H5.3 ; v1(8.89,9.35) 6.98,9.35 R15.2
  Top Layer w0.5: U5.2 43.81,25.73 46.51,23.03 64.08,23.03 66.8,25.75 OLED1.2 ; 63.88,65.86 66.92,62.81 71.62,62.81 72.89,61.54 H3.7 75.81,57.99 75.81,39.44 76.96,38.3 76.96,33.35 73.27,29.67 67.43,29.67 66.8,29.03 OLED1.2 ; OLED1.2 69.23,25.2 69.23,12.8 61.21,4.77 52.32,4.77 50.41,6.68 50.41,10.39 U16.1
  Top Layer w0.6: U1.6 U1.5 19.68,62.31 18.41,63.58 H1.9
  Top Layer w0.9: D5.2 23.18,3.61 23.18,9.22 ; 21.71,11.31 21.01,11.31 20.31,12.01 20.31,16.46 23.36,19.51 48.47,19.51 54.24,13.74 53.41,13.74 52.19,12.52 U16.1
  Bottom Layer w0.4: H5.4 H5.3 ; v1(24.25,1.47) 16.76,1.47 v1(8.89,9.35)
VCCBAT_IN: length 9.5
  Top Layer w0.4: U18.1 10.15,45.16 5.74,45.16 SW5.3
VCCCAM: length 35
  Top Layer w0.4: v1(23.49,16.46) 23.49,15.25 U9.1 23.43,14.69 U7.5 23.64,13.38 24.51,12.52 27.11,12.52 C13.2 29.21,10.81 29.21,6.81 P1.1 ; R13.1 v1(8.89,13.1)
  Bottom Layer w0.4: v1(23.49,16.46) 20.13,13.1 v1(8.89,13.1)
PA0: length 57.7
  Top Layer w0.4: U1.38 38.1,36.28 41.73,36.28 51.04,45.59 51.04,66.27 53.34,68.56 58.64,68.56 60.19,67 65.15,67 H5.6
PA1: length 59.5
  Top Layer w0.4: U1.39 38.73,32.33 37.97,33.09 35.43,33.09 34.92,33.6 34.92,35.64 36.06,36.78 41.52,36.78 50.54,45.8 50.54,66.48 53.13,69.06 60.67,69.06 61.34,68.4
PA2: length 54
  Inner2 w0.4: U1.40 38.73,35.13 39.87,36.27 42.67,36.27 45.33,38.94 45.33,63.7 51.13,69.5 58.09,69.5 61.34,66.25 H5.1
PA3: length 51.6
  Bottom Layer w0.4: H5.5 66.42,46.91 62.89,43.38 50.54,43.38 42.54,35.38 42.54,33.09 U1.41
PA4: length 30.5
  Inner2 w0.4: P1.7 38.73,5.79 40,7.06 40,33.09 U1.42
PA5: length 39.1
  Inner2 w0.4: P1.5 36.19,5.79 37.46,7.06 37.46,32.57 37.86,32.97 38.98,32.97 40.04,34.02 40.04,35.19 40.49,35.64 41.78,35.64 42.54,34.87 42.54,33.09 U1.43
PA6: length 32.8
  Bottom Layer w0.4: P1.15 47.75,6.04 47.75,32.59 47.24,33.09 45.08,33.09 U1.44
PA7: length 71.5
  Inner1 w0.4: H1.10 3.67,60.27 3.67,51.82 8.93,46.56 19.29,46.56 20.6,45.26 20.6,42.72 22.47,40.84 25.7,40.84 25.96,40.59 28.06,40.59 29.71,38.94 29.71,30.81 30.09,30.43 44.95,30.43 U1.45
PA9: length 72.4
  Inner2 w0.4: P1.16 48.89,9.85 50.41,11.38 50.41,26.71 52.7,29 52.7,57.97 53.1,58.37 56.89,58.37 59.18,60.65 59.18,67.13 57.82,68.49 55.07,68.49 U1.80
PA10: length 68.2
  Inner2 w0.4: U1.79 58.29,65.61 58.29,61.54 57.78,61.03 53.34,61.03 51.68,59.38 51.68,38.94 50.03,37.29 50.03,28.87 49.53,28.36 49.53,11.76 46.35,8.58 P1.14
PB0: length 13.2
  Top Layer w0.4: U1.48 50.16,35.64 57.91,35.64 R7.1
PB6: length 39.4
  Inner2 w0.4: U1.22 29.71,38.3 29.71,23.44 32.11,21.05 32.11,10.38 33.14,9.35 34.28,9.35 P1.6
PB8: length 35.2
  Inner2 w0.4: U1.24 27.17,38.3 27.17,24.46 31.24,20.39 31.24,9.85 P1.4
PB9: length 32.6
  Inner2 w0.4: U1.25 24.59,35.8 24.59,25.26 30.22,19.63 30.22,8.33 P1.2
PB10: length 6.7
  Top Layer w0.4: U1.59 60.49,38 R5.1
PB12: length 21.6
  Top Layer w0.4: R6.1 71.03,34.83 69.72,36.14 69.72,38.43 66.8,41.35 59.69,41.35 U1.61
PB13: length 52.3
  Inner1 w0.4: H1.3 9.52,55.55 8.32,54.35 8.32,51.7 9.01,51 44.95,51 48.76,47.19 53.84,47.19 U1.64
PB14: length 49.6
  Inner1 w0.4: U1.63 55.11,48.46 49.02,48.46 44.06,53.42 H1.1
PB15: length 48.1
  Inner1 w0.4: U1.66 51.56,49.61 45.33,55.83 16.63,55.83 13.97,58.5 H1.5
PC0: length 44.2
  Inner1 w0.4: H1.4 5.93,55.95 4.31,54.34 4.31,51.89 9.14,47.06 19.81,47.06 21.59,45.28 21.59,44.65 22.98,43.25 26.23,43.25 26.27,43.21 28.99,43.21 31.11,41.1 U1.34
PC1: length 51
  Inner1 w0.4: H1.6 8.25,57.22 8.25,55.07 7.87,54.69 6.22,54.69 5.78,54.24 5.78,51.44 8.72,48.5 20.12,48.5 22.96,45.67 29.04,45.67 32.51,42.2 32.51,32.97 U1.35
PC8: length 64.7
  Inner2 w0.4: P1.12 48.64,12.27 48.64,28.65 47.49,29.79 47.49,36.52 50.54,39.57 50.54,60.67 53.44,63.58 55.24,63.58 U1.75
PC9: length 66.7
  Inner2 w0.4: U1.78 52.83,64.84 49.4,61.42 49.4,40.21 44.95,35.76 44.95,30.17 45.59,29.54 46.39,29.54 47.79,28.14 47.79,13.07 43.56,8.84 42.67,8.84 P1.10
PC11: length 71.8
  Inner2 w0.4: U1.9 22.09,55.83 22.09,53.96 22.64,53.42 24.12,53.42 24.76,52.78 24.76,51.49 24.02,50.75 22.85,50.75 22.39,50.28 22.39,25.82 28.7,19.51 28.7,7.44 29.97,6.17 34.31,6.17 34.92,5.56 34.92,4.27 35.56,3.63 36.95,3.63 37.46,4.14 37.46,6.17 P1.8
PC12: length 79.9
  Inner2 w0.4: P1.9 41.27,3.88 38.98,1.6 28.7,1.6 25.65,4.65 25.65,18.74 20.95,23.44 20.95,57.22 22.22,58.5 25.52,58.5 26.03,57.99 U1.10
PC13: length 14.3
  Top Layer w0.4: U1.33 32.25,32.97 32.25,35.13 34.79,37.67 37.46,37.67 39.26,39.47 39.26,39.73 R3.1
PD1: length 24
  Inner2 w0.4: H4.3 17.39,67 20.31,67 21.2,66.11 26.66,66.11 27.68,65.1 27.68,56.34 U1.12
PD2: length 70.1
  Inner2 w0.4: P1.11 42.54,6.17 40.51,6.17 39.97,5.63 39.97,4.36 38.48,2.87 29.66,2.87 27.17,5.36 27.17,19.38 21.71,24.84 21.71,50.37 U1.13
PD3: length 29.8
  Inner2 w0.4: H4.4 17.35,69.5 26.2,69.5 28.32,67.38 28.32,54.43 U1.14
PD5: length 54.9
  Inner1 w0.4: OLED1.4 63.75,35.76 49.44,35.76 35.6,49.61 U1.16
PD6: length 55.7
  Inner1 w0.4: 69.34,27.64 63.75,33.22 48.25,33.22 47.62,33.86 47.62,35.25 34.67,48.21 24.63,48.21 U1.17
PD8: length 22.8
  Top Layer w0.4: R4.1 71.03,38.13 66.92,42.24 61.21,42.24 58.8,44.65 58.8,48.59 57.78,49.61 U1.65
PD10: length 17.5
  Top Layer w0.5: U1.67 65.27,60.91 H3.8
PE8: length 34.1
  Inner2 w0.4: H3.4 71.12,55.83 72.38,54.56 73.72,54.56 74.16,54.12 74.16,49.48 66.16,41.48
  Inner2 w0.5: U1.51 66.16,41.48
PE9: length 42.2
  Inner2 w0.4: U1.54 55.11,33.22 55.11,31.21 55.9,30.43 57.15,30.43 74.93,48.21 74.93,54.65 CN3.3
PE11: length 89.7
  Inner1 w0.4: U1.56 55.37,38.3 57.78,38.3 58.29,38.81 58.29,49.86 57.27,50.88 53.08,50.88 45.63,58.33 19.59,58.33 18.16,59.77 9.09,59.77 8.21,60.65 8.21,64.51 7.6,65.12 6.49,65.12 3.17,61.8 3.17,55.35 CN5.3
PE12: length 23.2
  Inner2 w0.4: H3.1 U1.55
PE13: length 29.8
  Inner2 w0.5: U1.58 55.24,40.72 57.78,40.72 59.05,41.98 59.05,47.19 68.96,57.1 71.62,57.1 H3.3
PE14: length 32.1
  Top Layer w0.4: U5.4 U5.4 38.73,28.14 40.38,29.79 43.81,29.79 45.21,31.19 45.21,37.35 50.98,43.13 54.73,43.13 55.24,42.62 55.24,40.72 U1.57
PE15: length 25.3
  Top Layer w0.4: U5.3 U5.3 41.27,28.27 42.29,29.28 46.22,29.28 47.75,30.81 47.75,39.19 50.55,41.98 U1.60
$1N2384: length 5.5
  Top Layer w0.4: SW5.2 8.51,38.17 Q8.1
$1N2385: length 16
  Top Layer w0.4: R12.2 8.25,40.44 D3.2 7.5,39.7 1.67,39.7 1.27,39.3 1.27,35.66 SW5.1
$1N2976: length 1.5
  Top Layer w0.4: R13.2 3.92,13.1 LED1.2
$1N2980: length 1.5
  Top Layer w0.4: LED4.2 5.35,11.25 R21.2
$1N3514: length 3.1
  Top Layer w0.5: R18.2 13.09,20.45 13.33,20.7 U11.4
$1N3515: length 3.3
  Top Layer w0.4: C14.1 18.47,19.36 17.14,20.7 U11.1
$1N3516: length 3.5
  Top Layer w0.4: U11.8 17.14,17.01 18.09,17.96 C14.2
$1N3520: length 1.5
  Top Layer w0.4: R14.1 R17.2
$1N3521: length 17.2
  Top Layer w0.4: R20.2 R17.1 13.59,7.86 12.06,9.39 12.06,14.6 13.33,15.87 U11.5
$1N3522: length 1.6
  Top Layer w0.5: C18.2 R19.1
$1N3523: length 5.9
  Top Layer w0.4: R19.2 12.19,15.5 12.19,16.38 12.78,16.97 14.22,16.97 14.6,16.59 U11.6
$1N3524: length 1.5
  Top Layer w0.4: LED3.2 5.33,9.49 R15.1
$1N3913: length 2.2
  Top Layer w0.4: R4.2 SW1.1
$1N3914: length 2.2
  Top Layer w0.4: R5.2 SW2.1
$1N3915: length 2.2
  Top Layer w0.4: R6.2 SW3.1
$1N3916: length 2.2
  Top Layer w0.4: R7.2 SW4.1
$1N4132: length 2.3
  Top Layer w0.4: R2.2 39.02,41 Q1.1
$1N4134: length 6.6
  Top Layer w0.4: BUZ1.1 37.5,43.29 R1.2
$1N4135: length 6.7
  Top Layer w0.4: BUZ1.2 39.97,46.95 Q1.3

## Copper pours and planes (outline as drawn; the poured copper is in the pictures)
GND on Top Layer: 0.5,5.92 7.11,5.92 7.11,0.84 0.5,0.84
GND on Top Layer: 74.8,6.93 79.12,6.93 79.12,1.34 74.8,1.34
GND on Top Layer: 74.8,69.04 78.99,69.04 78.99,64.34 74.8,64.34
GND on Top Layer: 5.2,21.54 9.36,21.54 9.36,16.97 5.2,16.97
GND on Top Layer: 0.69,69.04 5.2,69.04 5.2,65.23 0.69,65.23
GND on Top Layer: -39.88,102.69 132.2,102.69 132.2,-35.87 -39.88,-35.87
GND on Bottom Layer: 4.31,21.67 9.65,21.67 9.65,16.59 4.31,16.59
GND on Bottom Layer: 74.42,5.79 78.61,5.79 78.61,0.84 74.42,0.84
GND on Bottom Layer: -28.58,96.47 116.84,96.47 116.84,-16.31 -28.58,-16.31
GND on Bottom Layer: 0.5,5.41 6.13,5.41 6.13,1.43 0.5,1.43
GND on Bottom Layer: 1.27,69.04 4.69,69.04 4.69,65.23 1.27,65.23
GND on Bottom Layer: 75.03,69.03 78.99,69.03 78.99,64.84 75.03,64.84
GND on Inner1: -20.83,84.66 96.26,84.66 96.26,-5.51 -20.83,-5.51
GND on Inner2: -26.29,87.83 110.99,87.83 110.99,-18.21 -26.29,-18.21
VCC5V on Top Layer: 17.82,2.66 22.22,2.66 22.22,0.63 17.82,0.63
VCCBAT on Top Layer: 12.8,38.39 20.44,38.39 20.44,27.76 12.8,27.76
VCCBAT_IN on Top Layer: 4.82,45.54 13.2,45.54 13.2,23.95 4.82,23.95
$1N3513 on Top Layer: 14.3,26.16 19.33,26.16 19.33,20.7 14.3,20.7
$1N3513 on Top Layer: 12.19,30.48 19.33,30.48 19.33,22.96 12.19,22.96
$1N3516 on Top Layer: 16.63,16.63 19.17,16.63 19.17,13.08 16.63,13.08
$1N3518 on Top Layer: 16.38,10.79 22.22,10.79 22.22,4.95 16.38,4.95
$1N3518 on Top Layer: 12.95,11.17 19.3,11.17 19.3,8.57 12.95,8.57

## Text on the board
Top Layer: 广州城市 / 理工学院 | 2024年绘 | 原启队
Top Silkscreen Layer: G | E11 | C1 | A7 | C0 | NC | B15 | 5V | B13 | B14 | E25 | E26 | 3V3 | B10 | B0 | D10 | E8 | D8 | B12 | E13 | E12 | E9 | A2_E | A1_E | A0_P | A3_P
